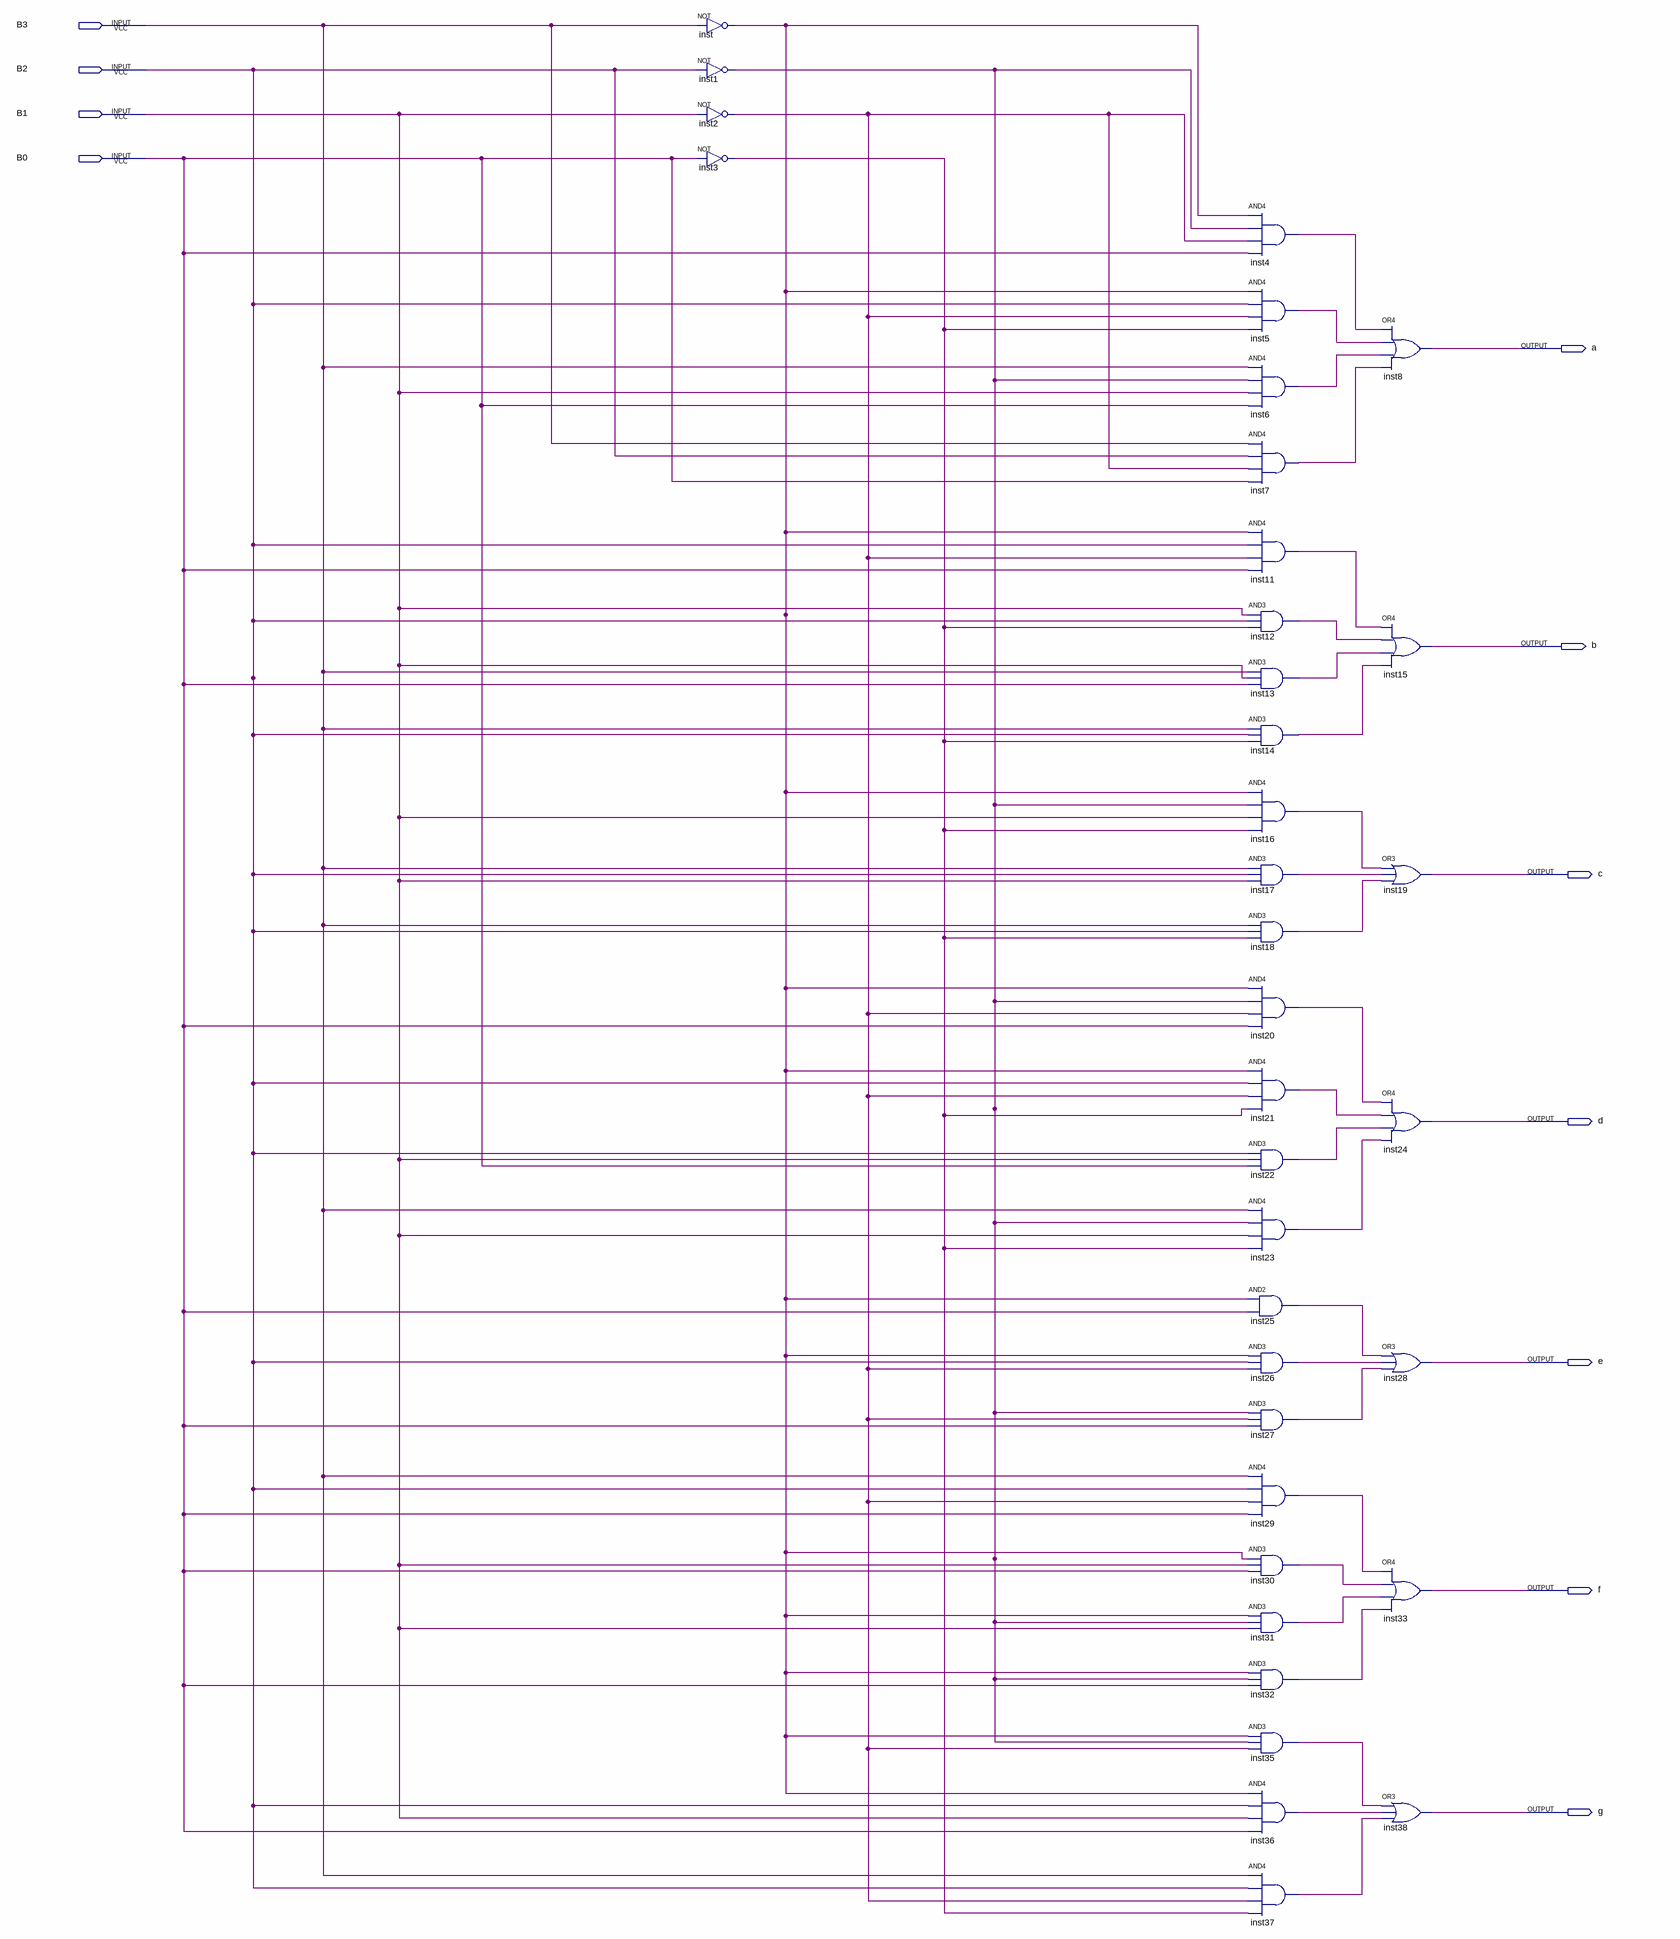
[diagram p0: schematic sheet]
// Quartus schematic DECODIFICADOR7SEGMENTOS.bdf as structural Verilog: 36 symbols, 11 pins
module DECODIFICADOR7SEGMENTOS (
  input  B3,
  input  B2,
  input  B1,
  input  B0,
  output a,
  output b,
  output c,
  output d,
  output e,
  output f,
  output g
);

  wire inst1_out, inst2_out, inst3_out, inst4_out, inst5_out, inst6_out, inst7_out, inst11_out, inst12_out,
       inst13_out, inst14_out, inst16_out, inst17_out, inst18_out, inst20_out, inst21_out, inst22_out,
       inst23_out, inst25_out, inst26_out, inst27_out, inst29_out, inst30_out, inst31_out, inst32_out,
       inst35_out, inst36_out, inst37_out, inst_out;

  not inst (inst_out, B3);
  not inst1 (inst1_out, B2);
  not inst2 (inst2_out, B1);
  not inst3 (inst3_out, B0);
  and inst4 (inst4_out, inst_out, inst1_out, inst2_out, B0);
  and inst5 (inst5_out, inst_out, B2, inst2_out, inst3_out);
  and inst6 (inst6_out, B3, inst1_out, B1, B0);
  and inst7 (inst7_out, B3, B2, inst2_out, B0);
  and inst11 (inst11_out, inst_out, B2, inst2_out, B0);
  and inst12 (inst12_out, B1, B2, inst3_out);
  and inst13 (inst13_out, B3, B1, B0);
  and inst14 (inst14_out, B3, B2, inst3_out);
  and inst16 (inst16_out, inst_out, inst1_out, B1, inst3_out);
  and inst17 (inst17_out, B3, B2, B1);
  and inst18 (inst18_out, B3, B2, inst3_out);
  and inst20 (inst20_out, inst_out, inst1_out, inst2_out, B0);
  and inst21 (inst21_out, inst_out, B2, inst2_out, inst3_out);
  and inst22 (inst22_out, B2, B1, B0);
  and inst23 (inst23_out, B3, inst1_out, B1, inst3_out);
  and inst25 (inst25_out, inst_out, B0);
  and inst26 (inst26_out, inst_out, B2, inst2_out);
  and inst27 (inst27_out, inst1_out, inst2_out, B0);
  and inst29 (inst29_out, B3, B2, inst2_out, B0);
  and inst30 (inst30_out, inst_out, B1, B0);
  and inst31 (inst31_out, inst_out, inst1_out, B1);
  and inst32 (inst32_out, inst_out, inst1_out, B0);
  and inst35 (inst35_out, inst_out, inst1_out, inst2_out);
  and inst36 (inst36_out, inst_out, B2, B1, B0);
  and inst37 (inst37_out, B3, B2, inst2_out, inst3_out);
  or inst8 (a, inst4_out, inst5_out, inst6_out, inst7_out);
  or inst15 (b, inst11_out, inst12_out, inst13_out, inst14_out);
  or inst19 (c, inst16_out, inst17_out, inst18_out);
  or inst24 (d, inst20_out, inst21_out, inst22_out, inst23_out);
  or inst28 (e, inst25_out, inst26_out, inst27_out);
  or inst33 (f, inst29_out, inst30_out, inst31_out, inst32_out);
  or inst38 (g, inst35_out, inst36_out, inst37_out);
endmodule
